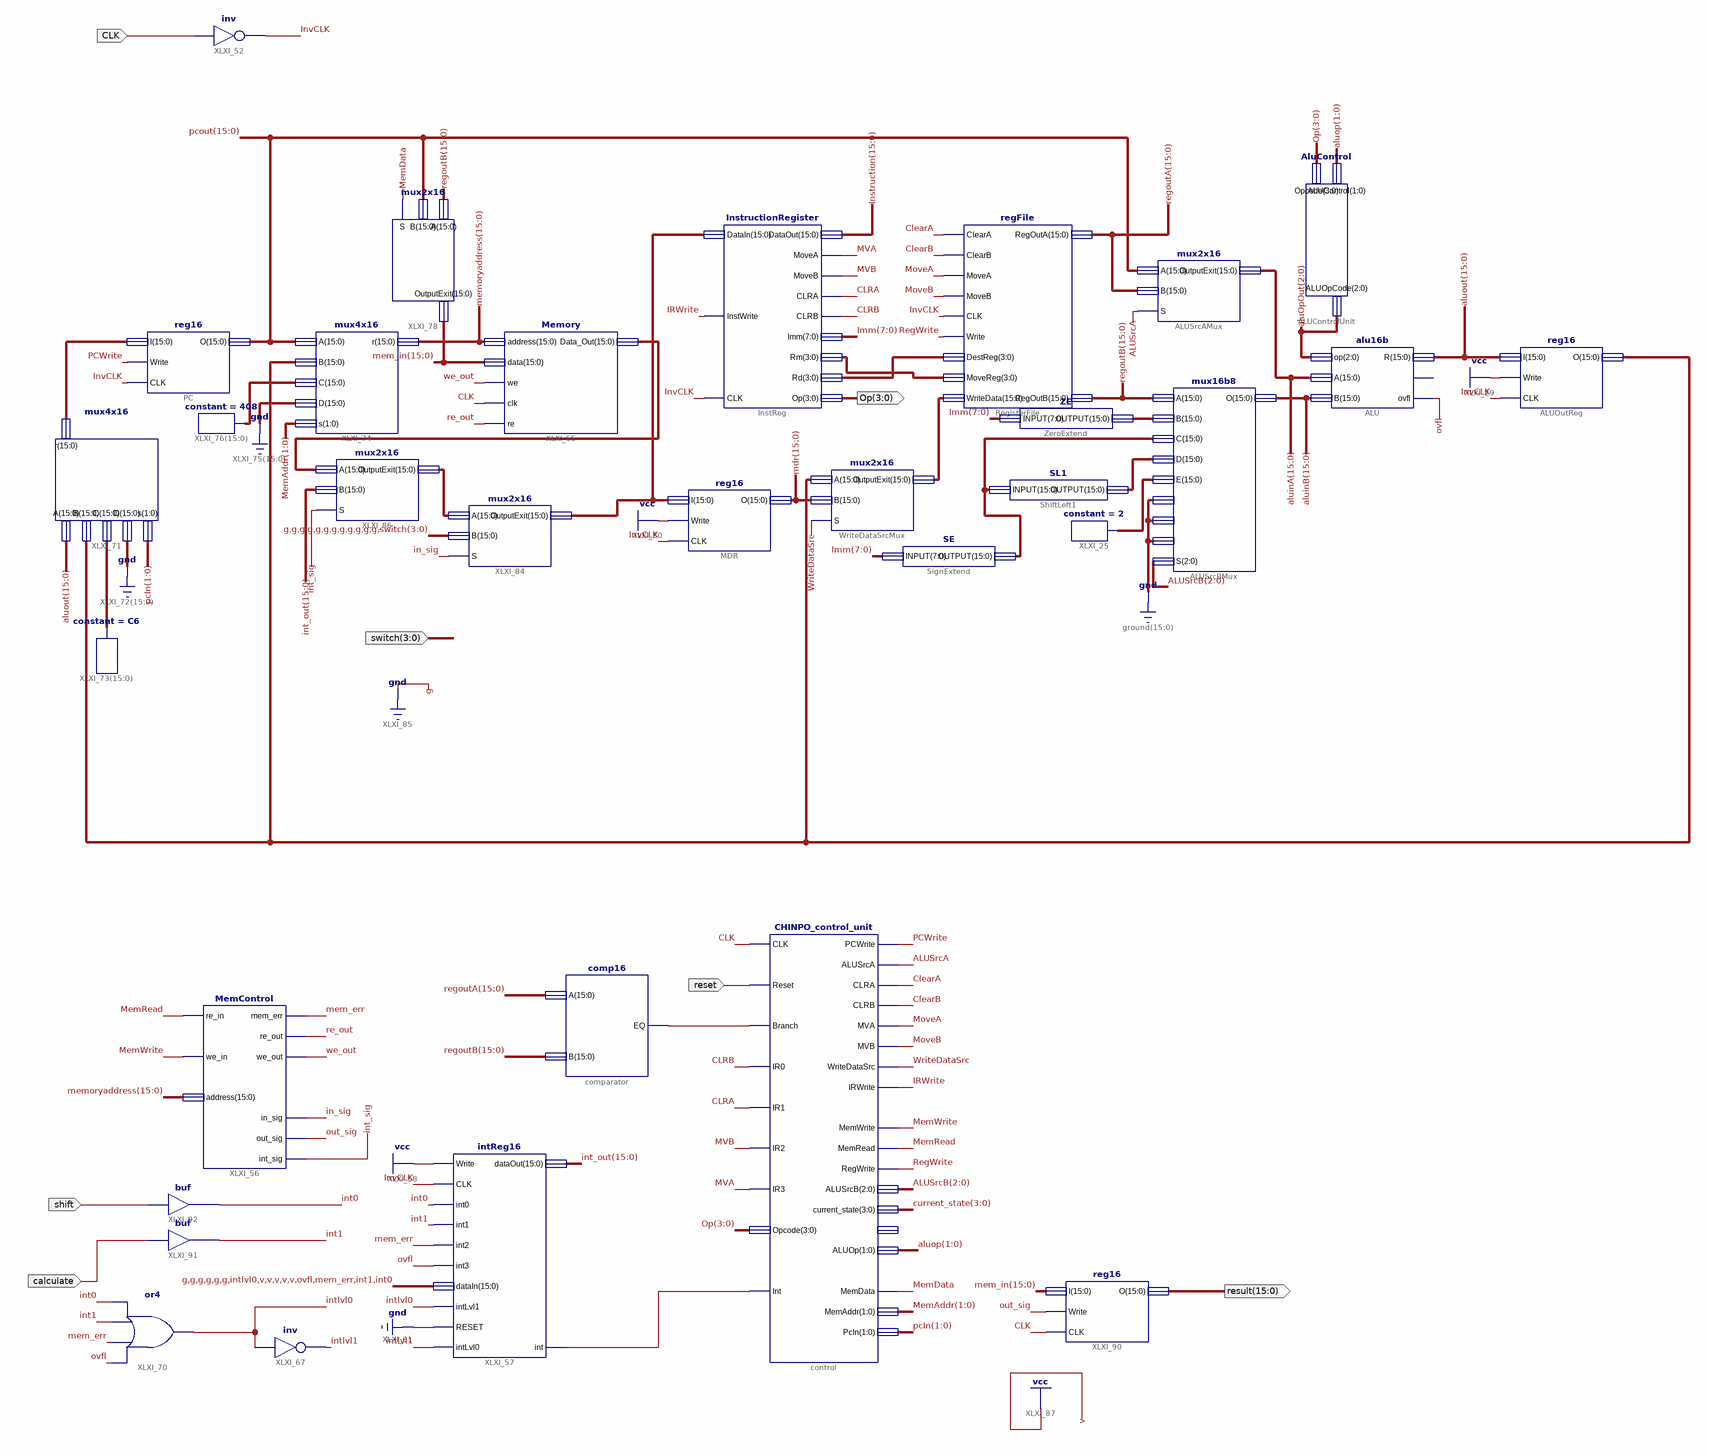
[diagram p0: schematic sheet 1]
// Xilinx ISE schematic Datapath.sch (spartan3e) as structural Verilog: 32 symbols, 7 ports
module Datapath (
  input  CLK,
  input  reset,
  input  shift,
  input  calculate,
  input  [3:0] switch,
  output [3:0] Op,
  output [15:0] result
);

  wire ALUSrcA, ClearA, ClearB, CLRA, CLRB, in_sig, int0, int1, int_sig, intlvl0, intlvl1, InvCLK, IRWrite,
       mem_err, MemData, MemRead, MemWrite, MoveA, MoveB, MVA, MVB, out_sig, ovfl, PCWrite, re_out, RegWrite,
       we_out, WriteDataSrc, XLXN_79, XLXN_189;
  wire [1:0] aluop, MemAddr, pcIn;
  wire [2:0] aluOpOut, ALUSrcB;
  wire [3:0] current_state, XLXN_6, XLXN_7;
  wire [7:0] Imm;
  wire [15:0] aluinA, aluinB, aluout, Instruction, int_out, mdr, mem_in, memoryaddress, pcout, regoutA,
       regoutB, XLXN_9, XLXN_26, XLXN_32, XLXN_33, XLXN_36, XLXN_141, XLXN_144, XLXN_175, XLXN_183, XLXN_213,
       XLXN_233, XLXN_234;

  reg16 PC (.I(XLXN_144), .Write(PCWrite), .CLK(InvCLK), .O(pcout));
  InstructionRegister InstReg (
    .DataIn(XLXN_213), .InstWrite(IRWrite), .CLK(InvCLK), .DataOut(Instruction), .MoveA(MVA), .MoveB(MVB),
    .CLRA(CLRA), .CLRB(CLRB), .Imm(Imm), .Rm(XLXN_7), .Rd(XLXN_6), .Op(Op));
  mux2x16 WriteDataSrcMux (.A(XLXN_141), .B(mdr), .S(WriteDataSrc), .OutputExit(XLXN_9));
  regFile RegisterFile (
    .ClearA(ClearA), .ClearB(ClearB), .MoveA(MoveA), .MoveB(MoveB), .CLK(InvCLK), .Write(RegWrite),
    .DestReg(XLXN_6), .MoveReg(XLXN_7), .WriteData(XLXN_9), .RegOutA(regoutA), .RegOutB(regoutB));
  reg16 u_MDR (.I(XLXN_213), .Write(1'b1), .CLK(InvCLK), .O(mdr));
  mux2x16 ALUSrcAMux (.A(pcout), .B(regoutA), .S(ALUSrcA), .OutputExit(aluinA));
  mux16b8 ALUSrcBMux (
    .A(regoutB), .B(XLXN_26), .C(XLXN_32), .D(XLXN_33), .E(XLXN_36), .F({16{1'b0}}), .G({16{1'b0}}),
    .H({16{1'b0}}), .S(ALUSrcB), .O(aluinB));
  ZE ZeroExtend (.INPUT(Imm), .OUTPUT(XLXN_26));
  SE SignExtend (.INPUT(Imm), .OUTPUT(XLXN_32));
  SL1 ShiftLeft1 (.INPUT(XLXN_32), .OUTPUT(XLXN_33));
  constant #(.CValue("2")) XLXI_25 (.O(XLXN_36));
  reg16 ALUOutReg (.I(aluout), .Write(1'b1), .CLK(InvCLK), .O(XLXN_141));
  CHINPO_control_unit control (
    .CLK(CLK), .Reset(reset), .Branch(XLXN_79), .IR0(CLRB), .IR1(CLRA), .IR2(MVB), .IR3(MVA), .Opcode(Op),
    .PCWrite(PCWrite), .ALUSrcA(ALUSrcA), .CLRA(ClearA), .CLRB(ClearB), .MVA(MoveA), .MVB(MoveB),
    .WriteDataSrc(WriteDataSrc), .IRWrite(IRWrite), .MemWrite(MemWrite), .MemRead(MemRead),
    .RegWrite(RegWrite), .ALUSrcB(ALUSrcB), .current_state(current_state), .ALUOp(aluop), .Int(XLXN_189),
    .MemData(MemData), .MemAddr(MemAddr), .PcIn(pcIn));  // open: next_state
  AluControl ALUControlUnit (.ALUControl(aluop), .Opcode(Op), .ALUOpCode(aluOpOut));
  alu16b ALU (.A(aluinA), .B(aluinB), .op(aluOpOut), .ovfl(ovfl), .R(aluout));  // open: zero
  not XLXI_52 (InvCLK, CLK);
  comp16 comparator (.A(regoutA), .B(regoutB), .EQ(XLXN_79));
  Memory XLXI_55 (.address(memoryaddress), .clk(CLK), .data(mem_in), .Data_Out(XLXN_234), .re(re_out), .we(we_out));
  MemControl XLXI_56 (
    .re_in(MemRead), .we_in(MemWrite), .address(memoryaddress), .mem_err(mem_err), .re_out(re_out),
    .we_out(we_out), .in_sig(in_sig), .out_sig(out_sig), .int_sig(int_sig));
  intReg16 XLXI_57 (
    .Write(1'b1), .CLK(InvCLK), .int0(int0), .int1(int1), .int2(mem_err), .int3(ovfl),
    .dataIn({{6{1'b0}}, intlvl0, {5{1'b1}}, ovfl, mem_err, int1, int0}), .intLvl1(intlvl0), .RESET(1'b0),
    .intLvl0(intlvl1), .dataOut(int_out), .\int (XLXN_189));
  not XLXI_67 (intlvl1, intlvl0);
  or XLXI_70 (intlvl0, ovfl, mem_err, int1, int0);
  mux4x16 XLXI_71 (.A(aluout), .B(XLXN_141), .C(XLXN_175), .D({16{1'b0}}), .r(XLXN_144), .s(pcIn));
  constant #(.CValue("C6")) XLXI_73[15:0] (.O(XLXN_175));
  mux4x16 XLXI_74 (.A(pcout), .B(XLXN_141), .C(XLXN_183), .D({16{1'b0}}), .r(memoryaddress), .s(MemAddr));
  constant #(.CValue("408")) XLXI_76[15:0] (.O(XLXN_183));
  mux2x16 XLXI_78 (.A(regoutB), .B(pcout), .S(MemData), .OutputExit(mem_in));
  mux2x16 XLXI_84 (.A(XLXN_233), .B({{12{1'b0}}, switch}), .S(in_sig), .OutputExit(XLXN_213));
  mux2x16 XLXI_86 (.A(XLXN_234), .B(int_out), .S(int_sig), .OutputExit(XLXN_233));
  reg16 XLXI_90 (.I(mem_in), .Write(out_sig), .CLK(CLK), .O(result));
  buf XLXI_91 (int1, calculate);
  buf XLXI_92 (int0, shift);
endmodule
